# EAGLE design compact (EAGLE 9.4.2)
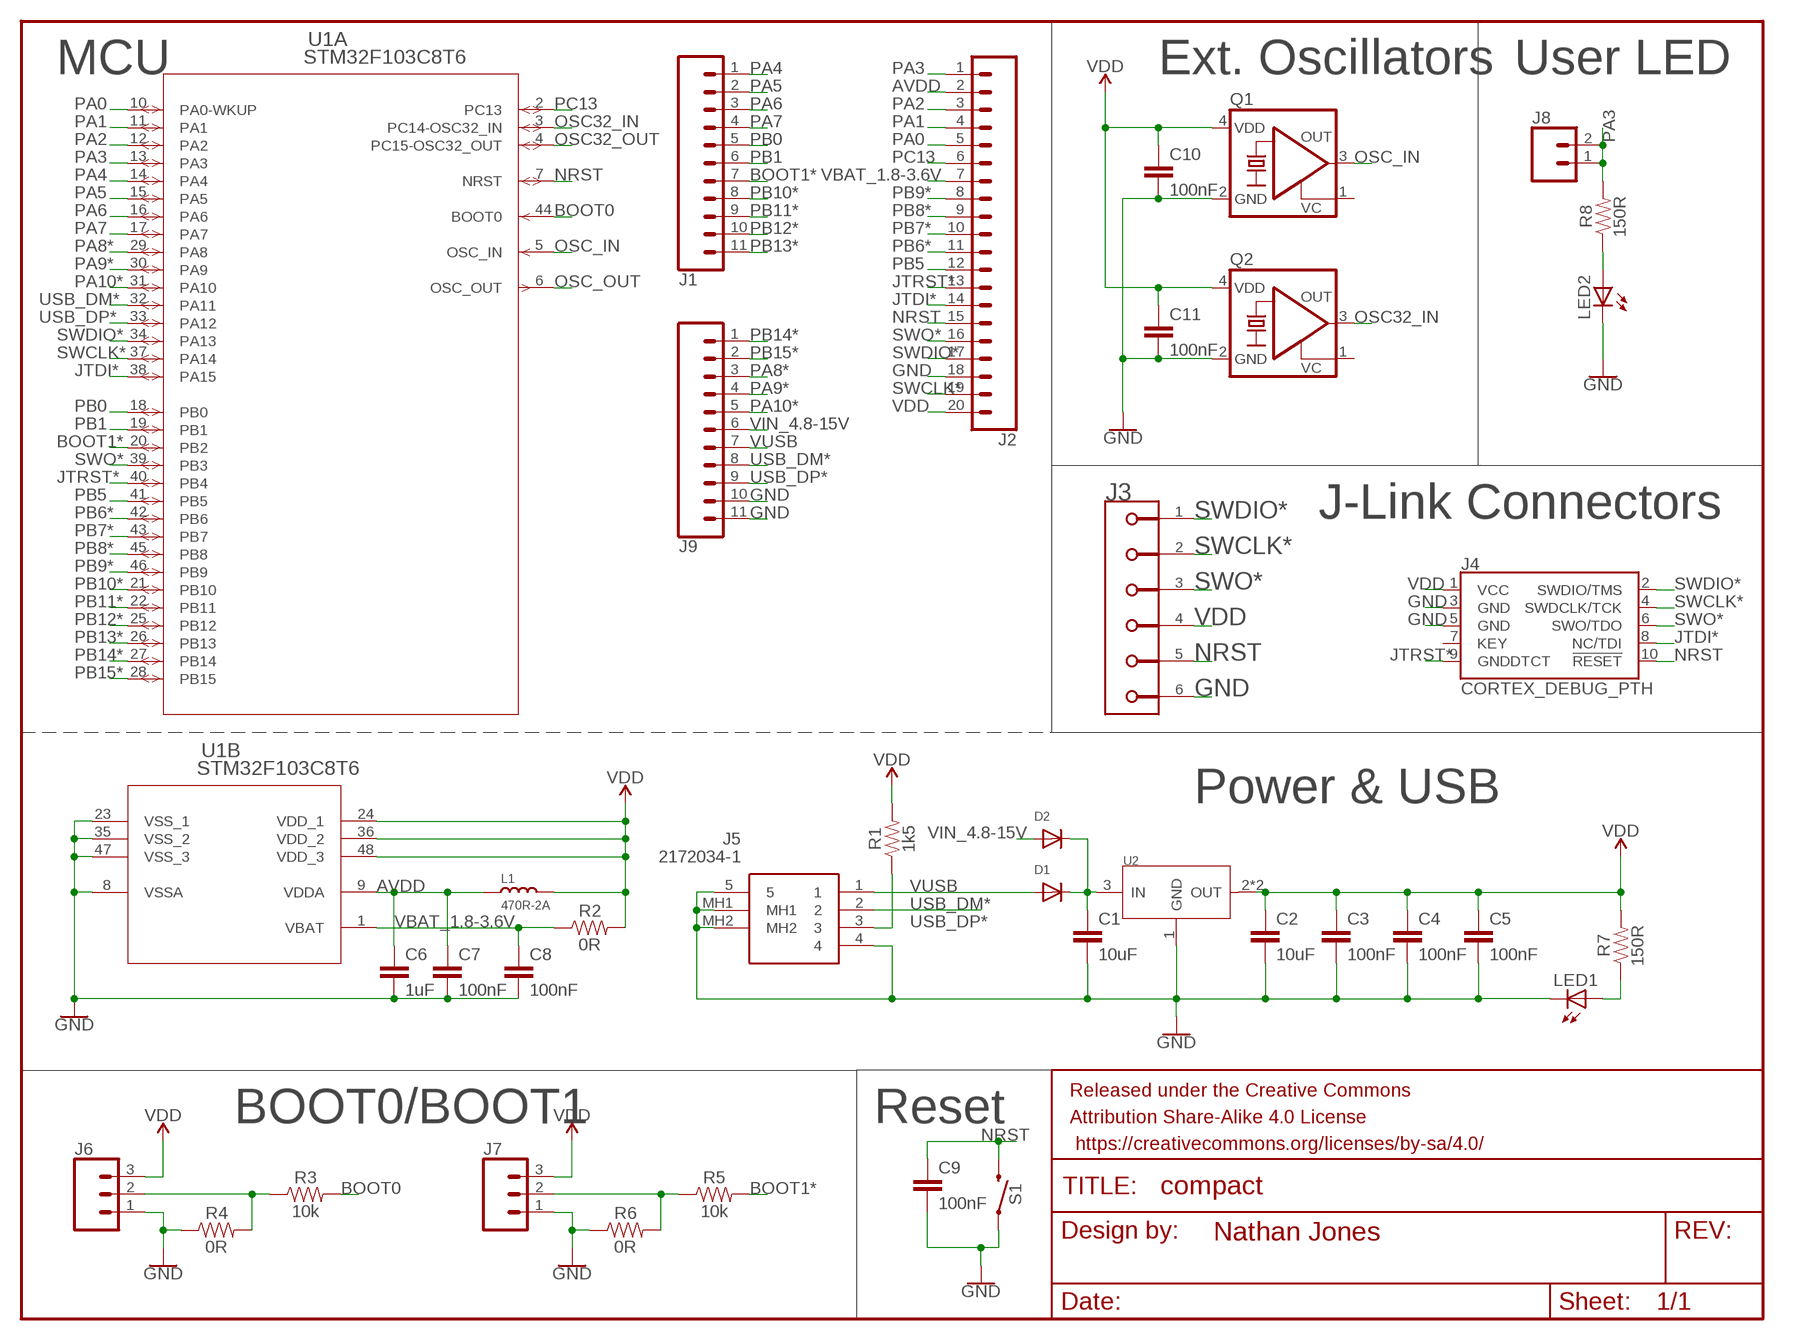
[diagram p0: schematic, sheet 1]

## Parts
C1  10uF  0.1UF-0402T-16V-10%  [0402-TIGHT]
C2  10uF  0.1UF-0402T-16V-10%  [0402-TIGHT]
C3  100nF  0.1UF-0402T-16V-10%  [0402-TIGHT]
C4  100nF  0.1UF-0402T-16V-10%  [0402-TIGHT]
C5  100nF  0.1UF-0402T-16V-10%  [0402-TIGHT]
C6  1uF  0.1UF-0402T-16V-10%  [0402-TIGHT]
C7  100nF  0.1UF-0402T-16V-10%  [0402-TIGHT]
C8  100nF  0.1UF-0402T-16V-10%  [0402-TIGHT]
C9  100nF  0.1UF-0402T-16V-10%  [0402-TIGHT]
C10  100nF  0.1UF-0402T-16V-10%  [0402-TIGHT]
C11  100nF  0.1UF-0402T-16V-10%  [0402-TIGHT]
D1  DIODESOD-123  [SOD-123]
D2  DIODESOD-123  [SOD-123]
FRAME2  FRAME-LETTERNO_PACKAGE  [DUMMY]
J1  CONN_111X11_NO_SILK  [1X11_NO_SILK]
J2  CONN_20NOSILK  [1X20_NOSILK]
J3  AVX_6-PIN_009159006061916_33MIL-GAP  [AVX_6-PIN_009159006061916_33MIL-GAP]
J4  CORTEX_DEBUG_PTH  [2X5-PTH-1.27MM]
J5  2172034-1  [21720341]
J6  CONN_031X03_NO_SILK  [1X03_NO_SILK]
J7  CONN_031X03_NO_SILK  [1X03_NO_SILK]
J8  CONN_021X02_NO_SILK  [1X02_NO_SILK]
J9  CONN_111X11_NO_SILK  [1X11_NO_SILK]
L1  470R-2A  SMD-FERRITE-BEAD-470R-2A(0805)'0805'  [L0805]
LED1  LEDCHIPLED_0603  [CHIPLED_0603]
LED2  LEDCHIPLED_0603  [CHIPLED_0603]
Q1  KXO-VCXO-CMOS_4  [3.2X2.5_KXO-84-TCXO]
Q2  KXO-VCXO-CMOS_4  [3.2X2.5_KXO-84-TCXO]
R1  1k5  RESISTOR0402  [0402]
R2  0R  RESISTOR0402  [0402]
R3  10k  RESISTOR0402  [0402]
R4  0R  RESISTOR0402  [0402]
R5  10k  RESISTOR0402  [0402]
R6  0R  RESISTOR0402  [0402]
R7  150R  RESISTOR0402  [0402]
R8  150R  RESISTOR0402  [0402]
S1  MOMENTARY-SWITCH-SPST-SMD-5.2-REDUNDANT  [TACTILE_SWITCH_SMD_5.2MM]
U1  STM32F103C8T6  [LQFP48-7X7MM]
U2  CJT1117-3.3-SOT223  PMIC-CJT1117-3.3(SOT223)  [SOT-223]

## Nets
AVDD: C6.1 C7.1 J2.2 L1.1 U1.9(B:VDDA)
BOOT0: R3.2 U1.44(A:BOOT0)
BOOT1*: J1.7 R5.2 U1.20(A:PB2)
GND: C1.2 C2.2 C3.2 C4.2 C5.2 C6.2 C7.2 C8.2 C9.2 C10.2 C11.2 J2.18 J3.6 J4.3(GND) J4.5(GND) J5.4 J5.5 J5.MH1 J5.MH2 J6.1 J7.1 J9.10 J9.11 LED1.C LED2.C Q1.2(GND) Q2.2(GND) R4.1 R6.1 S1.1 S1.2 U1.8(B:VSSA) U1.23(B:VSS_1) U1.35(B:VSS_2) U1.47(B:VSS_3) U2.1(GND)
JTDI*: J2.14 J4.8(NC/TDI) U1.38(A:PA15)
JTRST*: J2.13 J4.9(GNDDTCT) U1.40(A:PB4)
N$1: J6.2 R3.1 R4.2
N$4: LED2.A R8.1
N$6: J7.2 R5.1 R6.2
N$7: LED1.A R7.1
NRST: C9.1 J2.15 J3.5 J4.10(!RESET) S1.3 S1.4 U1.7(A:NRST)
OSC32_IN: Q2.3(OUT) U1.3(A:PC14-OSC32_IN)
OSC32_OUT: U1.4(A:PC15-OSC32_OUT)
OSC_IN: Q1.3(OUT) U1.5(A:OSC_IN)
OSC_OUT: U1.6(A:OSC_OUT)
PA0: J2.5 U1.10(A:PA0-WKUP)
PA1: J2.4 U1.11(A:PA1)
PA2: J2.3 U1.12(A:PA2)
PA3: J2.1 J8.1 J8.2 R8.2 U1.13(A:PA3)
PA4: J1.1 U1.14(A:PA4)
PA5: J1.2 U1.15(A:PA5)
PA6: J1.3 U1.16(A:PA6)
PA7: J1.4 U1.17(A:PA7)
PA8*: J9.3 U1.29(A:PA8)
PA9*: J9.4 U1.30(A:PA9)
PA10*: J9.5 U1.31(A:PA10)
PB0: J1.5 U1.18(A:PB0)
PB1: J1.6 U1.19(A:PB1)
PB5: J2.12 U1.41(A:PB5)
PB6*: J2.11 U1.42(A:PB6)
PB7*: J2.10 U1.43(A:PB7)
PB8*: J2.9 U1.45(A:PB8)
PB9*: J2.8 U1.46(A:PB9)
PB10*: J1.8 U1.21(A:PB10)
PB11*: J1.9 U1.22(A:PB11)
PB12*: J1.10 U1.25(A:PB12)
PB13*: J1.11 U1.26(A:PB13)
PB14*: J9.1 U1.27(A:PB14)
PB15*: J9.2 U1.28(A:PB15)
PC13: J2.6 U1.2(A:PC13)
SWCLK*: J2.19 J3.2 J4.4(SWDCLK/TCK) U1.37(A:PA14)
SWDIO*: J2.17 J3.1 J4.2(SWDIO/TMS) U1.34(A:PA13)
SWO*: J2.16 J3.3 J4.6(SWO/TDO) U1.39(A:PB3)
USB_DM*: J5.2 J9.8 U1.32(A:PA11)
USB_DP*: J5.3 J9.9 R1.1 U1.33(A:PA12)
VBAT_1.8-3.6V: C8.1 J2.7 R2.1 U1.1(B:VBAT)
VDD: C2.1 C3.1 C4.1 C5.1 C10.1 C11.1 J2.20 J3.4 J4.1(VCC) J6.3 J7.3 L1.2 Q1.4(VDD) Q2.4(VDD) R1.2 R2.2 R7.2 U1.24(B:VDD_1) U1.36(B:VDD_2) U1.48(B:VDD_3) U2.2(OUT) U2.TER(OUT)
VIN: C1.1 D1.C D2.C U2.3(IN)
VIN_4.8-15V: D2.A J9.6
VUSB: D1.A J5.1 J9.7
Unconnected: J4.7(KEY) Q1.1(VC) Q2.1(VC)

## Notes on the sheet
- MCU | Ext. Oscillators | User LED
- J-Link Connectors
- Power & USB
- BOOT0/BOOT1 | Reset

## Library data of the parts
C1 C2 = SparkFun-Capacitors:0.1UF: 0.1µF ceramic capacitors A capacitor is a passive two-terminal electrical component used to store electrical energy temporarily in an electric field.; LCSC_PART: C15525; PROD_ID: CAP-12416; VALUE: 0.1uF
C3-C5 C7-C11 = SparkFun-Capacitors:0.1UF: 0.1µF ceramic capacitors A capacitor is a passive two-terminal electrical component used to store electrical energy temporarily in an electric field.; LCSC_PART: C1525; PROD_ID: CAP-12416; VALUE: 0.1uF
C6 = SparkFun-Capacitors:0.1UF: 0.1µF ceramic capacitors A capacitor is a passive two-terminal electrical component used to store electrical energy temporarily in an electric field.; LCSC_PART: C52923; PROD_ID: CAP-12416; VALUE: 0.1uF
D1 D2 = adafruit:DIODE: Diode SMADIODE - SMA Surface Mount Package 20V 1A Schottky Diode Digikey: 641-1014-6-ND DO-1N4148 - Through Hole Small Current Diode SOD-123 20V 1 A (.5mV Vf) Schottky Diode - Digikey: MBRX120TPMSCT-ND SOD-323 10V 570mA (.38mV Vf, 3ns) Schottky Diode - Digikey: ZLLS410CT-ND SOD-523 30V 30mA Schottky Diode (RB751S-40TE61) - Digikey: RB751S-40TE61CT-ND SOT23-R/W - SOT23 Package (R = Solder Paste/Reflow Ovens, W = Hand-Soldering) BAT54Film 40V 300mA - Digikey: 497-7162-1-ND; LCSC_PART: C8598
FRAME2 = SparkFun-Aesthetics:FRAME-LETTER: Schematic Frame - Letter Standard 8.5x11 US Letter frame; DESIGNER: Nathan Jones; VERSION: v01
J1 J9 = SparkFun-Connectors:CONN_11: Multi connection point. Often used as Generic Header-pin footprint for 0.1 inch spaced/style header connections On any of the 0.1 inch spaced packages, you can populate with these: Break Away Headers - Straight <https://www.sparkfun.com/products/116> (PRT-00116) Break Away Male Headers - Right Angle <https://www.sparkfun.com/products/553> (PRT-00553) Female Headers <https://www.sparkfun.com/products/115> (PRT-00115) Break Away Headers - Machine Pin <https://www.sparkfun.com/products/117> (PRT-00117) Break Away Female Headers - Swiss Machine Pin <https://www.sparkfun.com/products/743> (PRT-00743) For SCREWTERMINALS and SPRING TERMINALS visit here: Screw Terimnals on SparkFun.com <https://www.sparkfun.com/search/results?term=Screw+Terminals> (5mm/3.5mm/2.54mm spacing) This device is also useful as a general connection point to wire up your design to another part of your project. Our various solder wires solder well into these plated through hole pads. Hook-Up Wire - Assortment (Stranded, 22 AWG) <https://www.sparkfun.com/products/11375> (PRT-11375) Hook-Up Wire - Assortment (Solid Core, 22 AWG) <https://www.sparkfun.com/products/11367> (PRT-11367) View the entire wire category on our website here <https://www.sparkfun.com/categories/141>
J2 = SparkFun-Connectors:CONN_20: Multi connection point. Often used as Generic Header-pin footprint for 0.1 inch spaced/style header connections On any of the 0.1 inch spaced packages, you can populate with these: Break Away Headers - Straight <https://www.sparkfun.com/products/116> (PRT-00116) Break Away Male Headers - Right Angle <https://www.sparkfun.com/products/553> (PRT-00553) Female Headers <https://www.sparkfun.com/products/115> (PRT-00115) Break Away Headers - Machine Pin <https://www.sparkfun.com/products/117> (PRT-00117) Break Away Female Headers - Swiss Machine Pin <https://www.sparkfun.com/products/743> (PRT-00743) For SCREWTERMINALS and SPRING TERMINALS visit here: Screw Terimnals on SparkFun.com <https://www.sparkfun.com/search/results?term=Screw+Terminals> (5mm/3.5mm/2.54mm spacing) This device is also useful as a general connection point to wire up your design to another part of your project. Our various solder wires solder well into these plated through hole pads. Hook-Up Wire - Assortment (Stranded, 22 AWG) <https://www.sparkfun.com/products/11375> (PRT-11375) Hook-Up Wire - Assortment (Solid Core, 22 AWG) <https://www.sparkfun.com/products/11367> (PRT-11367) View the entire wire category on our website here <https://www.sparkfun.com/categories/141> Special notes: Molex polarized connector foot print use with SKU : PRT-08231 with associated crimp pins and housings. 1MM SMD Version SKU: PRT-10208 NOTES ON THE VARIANTS LOCK and LOCK_LONGPADS... This footprint was designed to help hold the alignment of a through-hole component (i.e. 6-pin header) while soldering it into place. You may notice that each hole has been shifted either up or down by 0.005 of an inch from it's more standard position (which is a perfectly straight line). This slight alteration caused the pins (the squares in the middle) to touch the edges of the holes. Because they are alternating, it causes a "brace" to hold the component in place. 0.005 has proven to be the perfect amount of "off-center" position when using our standard breakaway headers. Although looks a little odd when you look at the bare footprint, once you have a header in there, the alteration is very hard to notice. Also,if you push a header all the way into place, it is covered up entirely on the bottom side. Note about LOCK SPECIAL package: This is just like the LOCK variant in that the holes are staggared by 5 mil, but except for the last two holes. They are not altered from the "standard" footprint layout. This is used for a special purpose on the layout of our Graphic LCD Backpack. Make sure you want to use this device before selecting it for you project!
J3 = Debug-Edge_AVX-connectors:AVX_6-PIN_009159006061916_33MIL-GAP
J4 = SparkFun-Connectors:CORTEX_DEBUG: Cortex Debug Connector - 10 pin Supports JTAG debug, Serial Wire debug, and Serial Wire Viewer. PTH and SMD connector options available. General Connector Information <http://infocenter.arm.com/help/topic/com.arm.doc.faqs/attached/13634/cortex_debug_connectors.pdf> Products: PTH Connector <http://www.digikey.com/product-detail/en/cnc-tech/3220-10-0100-00/1175-1627-ND/3883661> -via Digi-Key SparkFun PSoc <https://www.sparkfun.com/products/13229> SparkFun T <https://www.sparkfun.com/products/13810>
J5 = 2172034-1:2172034-1: CONN RCPT USB MINI B 2.0 PCB R/A Source: Datasheet <https://www.te.com/commerce/DocumentDelivery/DDEController?Action=srchrtrv&DocNm=2172034&DocType=Customer Drawing&DocLang=English>; ARROW_PART_NUMBER: 2172034-1; ARROW_PRICE-STOCK: https://www.arrow.com/en/products/2172034-1/te-connectivity; DESCRIPTION: CONN RCPT USB MINI B 2.0 PCB R/A; HEIGHT: 3.9mm; MANUFACTURER_NAME: TE Connectivity; MANUFACTURER_PART_NUMBER: 2172034-1; MOUSER_PART_NUMBER: 571-2172034-1; MOUSER_PRICE-STOCK: https://www.mouser.co.uk/ProductDetail/TE-Connectivity/2172034-1/?qs=Ev%252BS503VEAHBC%252BPBdsvCGg%3D%3D
J6 J7 = SparkFun-Connectors:CONN_03: Multi connection point. Often used as Generic Header-pin footprint for 0.1 inch spaced/style header connections On any of the 0.1 inch spaced packages, you can populate with these: Break Away Headers - Straight <https://www.sparkfun.com/products/116> (PRT-00116) Break Away Male Headers - Right Angle <https://www.sparkfun.com/products/553> (PRT-00553) Female Headers <https://www.sparkfun.com/products/115> (PRT-00115) Break Away Headers - Machine Pin <https://www.sparkfun.com/products/117> (PRT-00117) Break Away Female Headers - Swiss Machine Pin <https://www.sparkfun.com/products/743> (PRT-00743) Stackable Header - 3 Pin (Female, 0.1") <https://www.sparkfun.com/products/13875> (PRT-13875) For SCREWTERMINALS and SPRING TERMINALS visit here: Screw Terimnals on SparkFun.com <https://www.sparkfun.com/search/results?term=Screw+Terminals> (5mm/3.5mm/2.54mm spacing) This device is also useful as a general connection point to wire up your design to another part of your project. Our various solder wires solder well into these plated through hole pads. Hook-Up Wire - Assortment (Stranded, 22 AWG) <https://www.sparkfun.com/products/11375> (PRT-11375) Hook-Up Wire - Assortment (Solid Core, 22 AWG) <https://www.sparkfun.com/products/11367> (PRT-11367) View the entire wire category on our website here <https://www.sparkfun.com/categories/141> Special notes: Molex polarized connector foot print use with SKU : PRT-08232 with associated crimp pins and housings.
J8 = SparkFun-Connectors:CONN_02: Multi connection point. Often used as Generic Header-pin footprint for 0.1 inch spaced/style header connections On any of the 0.1 inch spaced packages, you can populate with these: Break Away Headers - Straight <https://www.sparkfun.com/products/116> (PRT-00116) Break Away Male Headers - Right Angle <https://www.sparkfun.com/products/553> (PRT-00553) Female Headers <https://www.sparkfun.com/products/115> (PRT-00115) Break Away Headers - Machine Pin <https://www.sparkfun.com/products/117> (PRT-00117) Break Away Female Headers - Swiss Machine Pin <https://www.sparkfun.com/products/743> (PRT-00743) For SCREWTERMINALS and SPRING TERMINALS visit here: Screw Terimnals on SparkFun.com <https://www.sparkfun.com/search/results?term=Screw+Terminals> (5mm/3.5mm/2.54mm spacing) This device is also useful as a general connection point to wire up your design to another part of your project. Our various solder wires solder well into these plated through hole pads. Hook-Up Wire - Assortment (Stranded, 22 AWG) <https://www.sparkfun.com/products/11375> (PRT-11375) Hook-Up Wire - Assortment (Solid Core, 22 AWG) <https://www.sparkfun.com/products/11367> (PRT-11367) View the entire wire category on our website here <https://www.sparkfun.com/categories/141> Special notes: Molex polarized connector foot print use with: PRT-08233 with associated crimp pins and housings. 2.54_SCREWTERM for use with PRT-10571. 3.5mm Screw Terminal footprints for PRT-08084 5mm Screw Terminal footprints for use with PRT-08432
L1 = OPL_Ferrite_and_Magnetic_Bead:SMD-FERRITE-BEAD-470R-2A(0805): 303030008; LCSC_PART: C1015; MPN: WLB2012-471T20
LED1 = adafruit:LED: LED OSRAM: - CHIPLED LG R971, LG N971, LY N971, LG Q971, LY Q971, LO R971, LY R971 LH N974, LH R974 LS Q976, LO Q976, LY Q976 LO Q996 - Hyper CHIPLED LW Q18S LB Q993, LB Q99A, LB R99A - SideLED LS A670, LO A670, LY A670, LG A670, LP A670 LB A673, LV A673, LT A673, LW A673 LH A674 LY A675 LS A676, LA A676, LO A676, LY A676, LW A676 LS A679, LY A679, LG A679 - Hyper Micro SIDELED® LS Y876, LA Y876, LO Y876, LY Y876 LT Y87S - SmartLED LW L88C, LW L88S LB L89C, LB L89S, LG L890 LS L89K, LO L89K, LY L89K LS L896, LA L896, LO L896, LY L896 - TOPLED LS T670, LO T670, LY T670, LG T670, LP T670 LSG T670, LSP T670, LSY T670, LOP T670, LYG T670 LG T671, LOG T671, LSG T671 LB T673, LV T673, LT T673, LW T673 LH T674 LS T676, LA T676, LO T676, LY T676, LB T676, LH T676, LSB T676, LW T676 LB T67C, LV T67C, LT T67C, LS T67K, LO T67K, LY T67K, LW E67C LS E67B, LA E67B, LO E67B, LY E67B, LB E67C, LV E67C, LT E67C LW T67C LS T679, LY T679, LG T679 LS T770, LO T770, LY T770, LG T770, LP T770 LB T773, LV T773, LT T773, LW T773 LH T774 LS E675, LA E675, LY E675, LS T675 LS T776, LA T776, LO T776, LY T776, LB T776 LHGB T686 LT T68C, LB T68C - Hyper Mini TOPLED® LB M676 - Mini TOPLED Santana® LG M470 LS M47K, LO M47K, LY M47K Source: http://www.osram.convergy.de/; LCSC_PART: C72041
LED2 = adafruit:LED: LED OSRAM: - CHIPLED LG R971, LG N971, LY N971, LG Q971, LY Q971, LO R971, LY R971 LH N974, LH R974 LS Q976, LO Q976, LY Q976 LO Q996 - Hyper CHIPLED LW Q18S LB Q993, LB Q99A, LB R99A - SideLED LS A670, LO A670, LY A670, LG A670, LP A670 LB A673, LV A673, LT A673, LW A673 LH A674 LY A675 LS A676, LA A676, LO A676, LY A676, LW A676 LS A679, LY A679, LG A679 - Hyper Micro SIDELED® LS Y876, LA Y876, LO Y876, LY Y876 LT Y87S - SmartLED LW L88C, LW L88S LB L89C, LB L89S, LG L890 LS L89K, LO L89K, LY L89K LS L896, LA L896, LO L896, LY L896 - TOPLED LS T670, LO T670, LY T670, LG T670, LP T670 LSG T670, LSP T670, LSY T670, LOP T670, LYG T670 LG T671, LOG T671, LSG T671 LB T673, LV T673, LT T673, LW T673 LH T674 LS T676, LA T676, LO T676, LY T676, LB T676, LH T676, LSB T676, LW T676 LB T67C, LV T67C, LT T67C, LS T67K, LO T67K, LY T67K, LW E67C LS E67B, LA E67B, LO E67B, LY E67B, LB E67C, LV E67C, LT E67C LW T67C LS T679, LY T679, LG T679 LS T770, LO T770, LY T770, LG T770, LP T770 LB T773, LV T773, LT T773, LW T773 LH T774 LS E675, LA E675, LY E675, LS T675 LS T776, LA T776, LO T776, LY T776, LB T776 LHGB T686 LT T68C, LB T68C - Hyper Mini TOPLED® LB M676 - Mini TOPLED Santana® LG M470 LS M47K, LO M47K, LY M47K Source: http://www.osram.convergy.de/; LCSC_PART: C72038
Q1 = crystal-geyer_V1_0:KXO-VCXO-CMOS_4: VCXO : CMOS - Serie Model Size l/w/h [mm] Frequency Range Frequency Stability Temp. Range [°C] Output AECQ 200 availabel Datasheet KXO-84 3.2/2.5/1.0 1.25 ~ 54.0 MHz ±10 … ±50ppm (*) -40°C …+85°C CMOS - KXO-84.pdf <http://www.geyer-electronic.de/uploads/tx_userartikelfrequenz/GEYER-KXO-84-VCXO-CMOS.pdf> <http://www.geyer-electronic.de/fileadmin/template/img/logo-geyer-electronic.png> Details see: http://www.geyer-electronic.de/Frequenz-Produkte.9.0.html Created 2016-06-07, Hans Locher 2016 (C) Geyer Quartz Technology KX84;3,2x2,5;3.2x2.5;3225; LCSC_PART: C39097
Q2 = crystal-geyer_V1_0:KXO-VCXO-CMOS_4: VCXO : CMOS - Serie Model Size l/w/h [mm] Frequency Range Frequency Stability Temp. Range [°C] Output AECQ 200 availabel Datasheet KXO-84 3.2/2.5/1.0 1.25 ~ 54.0 MHz ±10 … ±50ppm (*) -40°C …+85°C CMOS - KXO-84.pdf <http://www.geyer-electronic.de/uploads/tx_userartikelfrequenz/GEYER-KXO-84-VCXO-CMOS.pdf> <http://www.geyer-electronic.de/fileadmin/template/img/logo-geyer-electronic.png> Details see: http://www.geyer-electronic.de/Frequenz-Produkte.9.0.html Created 2016-06-07, Hans Locher 2016 (C) Geyer Quartz Technology KX84;3,2x2,5;3.2x2.5;3225; LCSC_PART: C387415
R1 = SparkFun-Resistors:RESISTOR: Generic Resistor Package; LCSC_PART: C25867
R2 R4 R6 = SparkFun-Resistors:RESISTOR: Generic Resistor Package; LCSC_PART: C17168
R3 R5 = SparkFun-Resistors:RESISTOR: Generic Resistor Package; LCSC_PART: C25744
R7 R8 = SparkFun-Resistors:RESISTOR: Generic Resistor Package; LCSC_PART: C25082
S1 = SparkFun-Switches:MOMENTARY-SWITCH-SPST: Momentary Switch (Pushbutton) - SPST Normally-open (NO) SPST momentary switches (buttons, pushbuttons). Variants PTH-12MM - 12mm square, through-hole Momentary Pushbutton Switch - 12mm Square <https://www.sparkfun.com/products/9190> (COM-09190) PTH-6.0MM, PTH-6.0MM-KIT - 6.0mm square, through-hole Mini Pushbutton Switch <https://www.sparkfun.com/products/97> (COM-00097) KIT package intended for soldering kit's - only one side of pads' copper is exposed. PTH-RIGHT-ANGLE-KIT - Right-angle, through-hole Right Angle Tactile Button <https://www.sparkfun.com/products/10791> - Used on SparkFun BigTime Watch Kit <https://www.sparkfun.com/products/11734> SMD-12MM - 12mm square, surface-mount Tactile Button - SMD (12mm) <https://www.sparkfun.com/products/12993> (COM-12993) Used on SparkFun PicoBoard <https://www.sparkfun.com/products/11888> SMD-4.5MM - 4.5mm Square Trackball Switch Used on SparkFun Blackberry Trackballer Breakout <https://www.sparkfun.com/products/13169> SMD-4.6MMX2.8MM - 4.60mm x 2.80mm, surface mount Used on SparkFun SAMD21 Mini Breakout <https://www.sparkfun.com/products/13664> SMD-5.2MM, SMD-5.2-REDUNDANT - 5.2mm square, surface-mount Mini Pushbutton Switch - SMD <https://www.sparkfun.com/products/8720> (COM-08720) Used on Arduino Pro Mini <https://www.sparkfun.com/products/11114> REDUNDANT package connects both switch circuits together SMD-6.0X3.5MM - 6.0 x 3.5mm, surface mount Momentary Reset Switch SMD <https://www.sparkfun.com/products/8229> (COM-08229) SMD-6.2MM-TALL - 6.2mm square, surface mount Tactile Button - SMD (6mm) <https://www.sparkfun.com/products/12992> Used on SparkFun Digital Sandbox <https://www.sparkfun.com/products/12651> SMD-RIGHT-ANGLE - Right-angle, surface mount Used on SparkFun Block for Intel® Edison - Arduino <https://www.sparkfun.com/products/13036>; LCSC_PART: C318884; PROD_ID: SWCH-08247; SF_SKU: COM-08720
U1 = STM32F103C8T6:STM32F103C8T6; BUILT_BY: EMA_UL_Team; COPYRIGHT: Copyright (C) 2018 Accelerated Designs. All rights reserved; LCSC_PART: C94046; MANUFACTURER_PART_NUMBER: STM32F103C8T6; SOURCELIBRARY: Updates_to_database_2020-10-19; VENDOR: STMicroelectronics
U2 = OPL_IC:PMIC-CJT1117-3.3(SOT223): 310030097; LCSC_PART: C6186; MPN: CJT1117-3.3

## Board
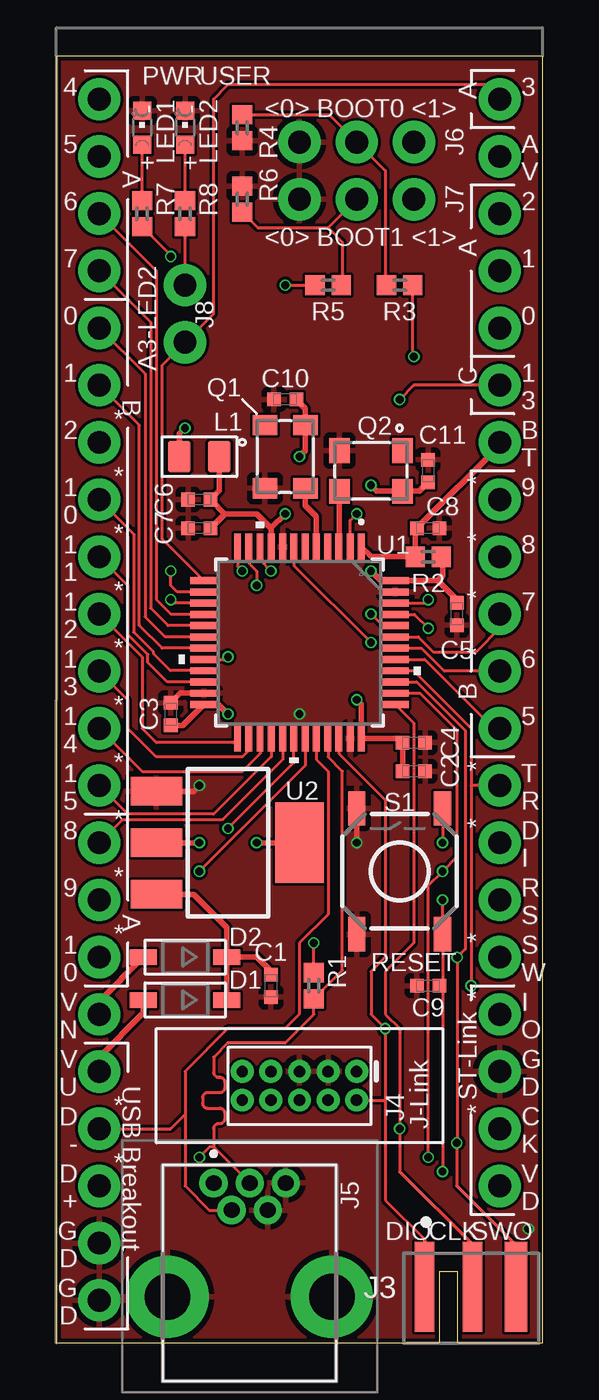
[diagram p1: board, top side]
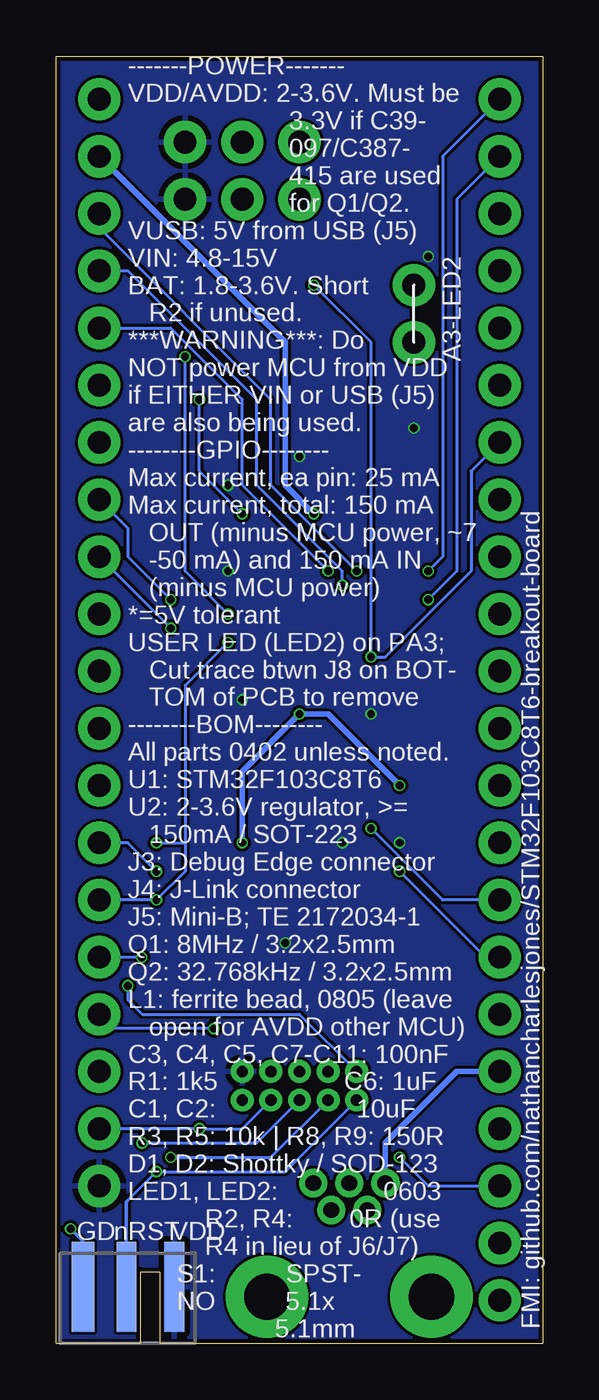
[diagram p2: board, bottom side, seen from below]

Size 21.59 x 57.15 mm. Coordinates in mm from the lower left corner, seen from the top.
Outline: 21.59,0 21.59,57.15 0,57.15 0,0 16.99,0 16.99,3.17 17.83,3.17 17.83,0 21.59,0
Copper layers (1*16): Top 0.035mm / dielectric 1.6mm / Bottom 0.035mm
Design rules "jlcpcb-2layers": minimum track width 5mil, minimum drill 0.3mm, track to track 5mil, track to pad 5mil, pad to pad 5mil, via to via 5mil, smd to smd 5mil, copper to edge 0.2mm, drill to drill 6mil, minimum pad ring 10mil, minimum via ring 3mil, stop-mask expansion 4mil, vias tented up to drill 0mil, thermal gap 10mil

### Footprints (pad centres in the part's own frame; a part is rotated, then mirrored left to right if it is on the bottom)
0402-TIGHT = smd 0.6 x 0.6: 1 -0.5,0; 2 0.5,0
SOD-123 = smd 1.2 x 0.7: A 1.85,0; C -1.85,0
1X11_NO_SILK = drill 1.016 pad 1.88: 1 0,0; 2 2.54,0; 3 5.08,0; 4 7.62,0; 5 10.16,0; 6 12.7,0; 7 15.24,0; 8 17.78,0; 9 20.32,0; 10 22.86,0; 11 25.4,0
1X20_NOSILK = drill 1.016 pad 1.88: 1 0,0; 2 2.54,0; 3 5.08,0; 4 7.62,0; 5 10.16,0; 6 12.7,0; 7 15.24,0; 8 17.78,0; 9 20.32,0; 10 22.86,0; 11 25.4,0; 12 27.94,0; 13 30.48,0; 14 33.02,0; 15 35.56,0; 16 38.1,0; 17 40.64,0; 18 43.18,0; 19 45.72,0; 20 48.26,0
AVX_6-PIN_009159006061916_33MIL-GAP = smd 0.873 x 4: 1 -2.063,2.5; 2 0.064,2.5 | smd 1 x 4: 3 2,2.5 | smd 0.873 x 4 bottom: 4 -2.063,2.5; 5 0.064,2.5 | smd 1 x 4 bottom: 6 2,2.5
2X5-PTH-1.27MM = drill 0.508 pad 1: 1 -2.54,-0.635; 2 -2.54,0.635; 3 -1.27,-0.635; 4 -1.27,0.635; 5 0,-0.635; 6 0,0.635; 7 1.27,-0.635; 8 1.27,0.635; 9 2.54,-0.635; 10 2.54,0.635
21720341 = drill 0.7 pad 1.2: 1 0,0; 2 1.2,0.8; 3 0,1.6; 4 1.2,2.4; 5 0,3.2 | drill 2.025 pad 3.037: MH1 5.05,5.25; MH2 5.05,-2.05
1X03_NO_SILK = drill 1.016 pad 1.88: 1 0,0; 2 2.54,0; 3 5.08,0
1X02_NO_SILK = drill 1.016 pad 1.88: 1 0,0; 2 2.54,0
L0805 = smd 1.016 x 1.397: 1 -0.889,0; 2 0.889,0
CHIPLED_0603 = smd 0.8 x 0.8: A 0,-0.75; C 0,0.75
3.2X2.5_KXO-84-TCXO = smd 0.9 x 1.1: 1 -1.4,-0.9; 2 1.4,-0.9; 3 1.4,0.9; 4 -1.4,0.9
0402 = smd 0.85 x 0.9: 1 -0.58,0; 2 0.58,0
TACTILE_SWITCH_SMD_5.2MM = smd 1.524 x 0.762: 1 -2.794,1.905; 2 2.794,1.905; 3 -2.794,-1.905; 4 2.794,-1.905
LQFP48-7X7MM = smd 1.194 x 0.305: 1 -4.25,2.75; 2 -4.25,2.25; 3 -4.25,1.75; 4 -4.25,1.25; 5 -4.25,0.75; 6 -4.25,0.25; 7 -4.25,-0.25; 8 -4.25,-0.75; 9 -4.25,-1.25; 10 -4.25,-1.75; 11 -4.25,-2.25; 12 -4.25,-2.75; 25 4.25,-2.75; 26 4.25,-2.25; 27 4.25,-1.75; 28 4.25,-1.25; 29 4.25,-0.75; 30 4.25,-0.25; 31 4.25,0.25; 32 4.25,0.75; 33 4.25,1.25; 34 4.25,1.75; 35 4.25,2.25; 36 4.25,2.75 | smd 0.305 x 1.194: 13 -2.75,-4.25; 14 -2.25,-4.25; 15 -1.75,-4.25; 16 -1.25,-4.25; 17 -0.75,-4.25; 18 -0.25,-4.25; 19 0.25,-4.25; 20 0.75,-4.25; 21 1.25,-4.25; 22 1.75,-4.25; 23 2.25,-4.25; 24 2.75,-4.25; 37 2.75,4.25; 38 2.25,4.25; 39 1.75,4.25; 40 1.25,4.25; 41 0.75,4.25; 42 0.25,4.25; 43 -0.25,4.25; 44 -0.75,4.25; 45 -1.25,4.25; 46 -1.75,4.25; 47 -2.25,4.25; 48 -2.75,4.25
SOT-223 = smd 1.27 x 2.286: 1 -2.286,-3.175; 2 0,-3.175; 3 2.286,-3.175 | smd 3.556 x 2.159: TER 0,3.175

### Placement (x,y rotation side)
C1  9.53,15.88 270 top
C2  15.88,25.4 0 top
C3  5.08,27.94 90 top
C4  15.88,26.67 0 top
C5  17.78,32.38 270 top
C6  6.35,37.47 180 top
C7  6.35,36.2 180 top
C8  16.51,36.2 0 top
C9  16.51,15.88 180 top
C10  10.16,41.91 180 top
C11  16.51,38.73 90 top
D1  5.71,15.24 180 top
D2  5.71,17.14 180 top
FRAME2  0,0 0 top
J1  1.91,55.24 270 top
J2  19.68,55.24 270 top
J3  18.41,0 0 top
J4  10.79,11.43 180 top
J5  6.99,7.11 270 top
J6  10.79,53.34 0 top
J7  10.79,50.8 0 top
J8  5.71,44.45 90 top
J9  1.91,27.3 270 top
L1  6.35,39.37 180 top
LED1  3.81,53.98 0 top
LED2  5.71,53.98 0 top
Q1  10.16,39.37 270 top
Q2  13.97,38.73 180 top
R1  11.43,15.88 90 top
R2  16.51,34.92 0 top
R3  15.24,46.99 0 top
R4  8.26,53.98 90 top
R5  12.06,46.99 180 top
R6  8.26,50.8 270 top
R7  3.81,50.16 270 top
R8  5.71,50.16 270 top
S1  15.24,20.95 90 top
U1  10.79,31.11 270 top
U2  7.62,22.23 270 top

### Tracks (layer width: path | path; a pad name or v marks a point on that pad's centre or on a via)
AVDD  (via drill 0.35)
  Top 0.254: 9.54,36.17 8.89,36.83 7.49,36.83 | 9.54,36.17 9.54,36.22 v10.16,36.83 | 9.54,36.17 U1.9 | L1.1 7.24,37.85 C6.1 7.49,36.83 | C7.1 7.49,36.83
  Bottom 0.254: v10.16,36.83 11.43,38.1 11.43,44.45 J2.2
BOOT0  (via drill 0.35)
  Top 0.127: U1.44 14.49,31.86 v13.97,32.38 | v15.88,43.81 15.82,43.87 R3.2
  Bottom 0.127: v13.97,32.38 15.88,34.29 v15.88,43.81
BOOT1*  (via drill 0.35)
  Top 0.127: U1.20 7.5,30.36 v7.62,30.48 | v10.16,46.99 R5.2
  Bottom 0.127: v10.16,46.99 7.62,44.45 v7.62,30.48 6.99,30.48 3.17,34.29 3.17,38.73 J1.7
GND  (via drill 0.35)
  Top 0.254: U2.1 6.1,24.51 v6.35,24.77 | S1.2 v13.34,22.23 | C3.2 5.5,28.86 U1.23
  Bottom 0.152: J3.6 20.41,4.54 v20.95,5.08
  Bottom 0.254: v6.35,24.77 9.53,27.94 v10.79,27.94 13.34,25.4 v13.34,22.23
  pour Top: 0,57.15 21.59,57.15 21.59,0 0,0
JTDI*  (via drill 0.35)
  Top 0.127: U1.38 16.14,28.86 17.78,27.22 17.78,21.59 v17.14,20.95 16.51,20.32 v16.51,8.26
  Bottom 0.127: v16.51,8.26 12.06,8.26 J4.8 | v17.14,20.95 18.41,22.23 J2.14
JTRST*  (via drill 0.35)
  Top 0.127: U1.40 15.86,29.86 18.41,27.3 18.41,24.77 | J2.13 18.41,24.77 | 18.41,24.77 v18.41,15.88
  Bottom 0.127: v18.41,15.88 18.41,15.24 17.78,14.61 10.79,14.61 J4.9
N$1
  Top 0.127: R3.1 14.61,47.05 14.61,52.07 J6.2 12.12,54.55 R4.2
N$4
  Top 0.127: R8.1 LED2.A
N$6
  Top 0.127: 12.06,49.53 12.7,48.9 12.7,47.05 R5.1 | J7.2 12.06,49.53 | R6.2 8.95,49.53 12.06,49.53
N$7
  Top 0.127: R7.1 LED1.A
NRST  (via drill 0.35)
  Top 0.127: v17.14,19.68 S1.3 17.14,16.01 C9.1 17.14,15.74 v17.14,7.62 | U1.7 10.54,34.54 v13.97,31.11 | S1.4 v17.14,22.23
  Bottom 0.127: J2.15 v17.14,19.68 15.88,20.95 15.88,22.23 | J4.10 11.43,7.62 v17.14,7.62 18.41,6.35 | v13.97,31.11 15.88,29.21 15.88,22.23 | v17.14,22.23 15.88,22.23
  Bottom 0.152: 18.41,6.35 18.48,6.29 J3.5
OSC32_IN
  Top 0.254: Q2.3 12.57,35.39 U1.3
OSC_IN
  Top 0.254: U1.5 11.54,36.72 11.06,37.2 Q1.3
PA0  (via drill 0.35)
  Top 0.127: U1.10 9.04,34.77 v9.53,34.29
  Bottom 0.127: v9.53,34.29 13.34,38.1 13.34,41.91 16.51,45.09 J2.5
PA1  (via drill 0.35)
  Top 0.127: U1.11 8.54,34.63 8.89,34.29 v8.89,33.66
  Bottom 0.127: J2.4 18.41,47.62 12.7,41.91 12.7,38.1 8.89,34.29 v8.89,33.66
PA2  (via drill 0.35)
  Top 0.127: U1.12 8.04,34.5 v8.26,34.29
  Bottom 0.127: v8.26,34.29 12.06,38.1 12.06,41.91 19.68,49.53 J2.3
PA3
  Top 0.127: J2.1 19.05,55.88 7.62,55.88 6.99,55.24 6.99,45.72 J8.1 4.7,43.43 4.7,35.71 U1.13 | J8.2 R8.2
  Bottom 0.127: J8.1 J8.2
PA4  (via drill 0.35)
  Top 0.127: U1.14 5.37,33.37 5.08,33.66 v5.08,34.29
  Bottom 0.127: v5.08,34.29 4.45,34.92 4.45,52.7 J1.1
PA5  (via drill 0.35)
  Top 0.127: U1.15 5.24,32.87 v5.08,33.02
  Bottom 0.127: v5.08,33.02 3.81,34.29 3.81,50.8 J1.2
PA6
  Top 0.127: U1.16 5.1,32.37 4.45,33.02 4.45,47.62 J1.3
PA7
  Top 0.127: U1.17 4.96,31.86 4.19,32.64 4.19,45.34 J1.4
PA8*
  Top 0.127: U1.29 10.04,25.92 7.37,23.24 2.92,23.24 J9.3
PA9*  (via drill 0.35)
  Top 0.127: U1.30 10.54,25.79 v7.62,22.86
  Bottom 0.127: J9.4 4.45,19.68 v7.62,22.86
PA10*  (via drill 0.35)
  Top 0.127: U1.31 11.04,25.65 v6.35,20.95
  Bottom 0.127: v6.35,20.95 2.54,17.14 J9.5
PB0
  Top 0.127: U1.18 4.83,31.36 3.94,32.26 3.94,43.05 J1.5
PB1
  Top 0.127: U1.19 4.7,30.86 3.68,31.88 3.68,40.77 J1.6
PB5
  Top 0.127: U1.41 16.35,30.36 19.41,27.3 J2.12
PB6*
  Top 0.127: U1.42 16.21,30.86 17.23,29.84 J2.11
PB7*
  Top 0.127: U1.43 16.07,31.36 16.73,30.7 18.64,30.7 19.68,31.75 J2.10
PB8*  (via drill 0.35)
  Top 0.127: U1.45 15.89,32.37 v16.51,31.75
  Bottom 0.127: v16.51,31.75 J2.9
PB9*  (via drill 0.35)
  Top 0.127: U1.46 16.36,32.87 v16.51,33.02
  Bottom 0.127: v16.51,33.02 18.41,34.92 18.41,36.2 J2.8
PB10*
  Top 0.127: U1.21 5.06,29.86 4.32,30.61 4.32,30.69 3.43,31.58 3.43,35.94 J1.8
PB11*
  Top 0.127: U1.22 4.92,29.36 4.06,30.23 4.06,30.59 3.17,31.47 3.17,33.66 J1.9
PB12*
  Top 0.127: U1.25 7.85,26.67 4.45,26.67 3.81,27.3 3.81,30.48 J1.10
PB13*
  Top 0.127: U1.26 8.54,26.32 8.26,26.04 4.45,26.04 3.17,27.3 3.17,28.57 J1.11
PB14*
  Top 0.127: U1.27 9.04,26.19 8.26,25.4 3.81,25.4 J9.1
PB15*
  Top 0.127: U1.28 9.54,26.05 6.99,23.5 3.17,23.5 J9.2
PC13  (via drill 0.35)
  Top 0.127: U1.2 13.04,36.54 v13.34,36.83 | v15.24,41.91 15.88,42.55 J2.6
  Bottom 0.127: v13.34,36.83 15.24,38.73 v15.24,41.91
SWCLK*  (via drill 0.35)
  Top 0.127: U1.37 15.88,27.54 15.88,17.78 14.61,16.51 14.61,14.61 15.24,13.97 v15.24,9.53 15.24,7.62
  Top 0.152: J3.2 18.48,4.38 15.24,7.62
  Bottom 0.127: J2.19 v15.24,9.53 13.34,9.53 J4.4
SWDIO*  (via drill 0.35)
  Top 0.127: U1.34 12.54,26.19 14.61,24.13 14.61,17.14 13.97,16.51 13.97,14.61 v14.61,13.97 14.61,10.79 | 14.61,10.79 14.61,6.35 16.35,4.6 | J4.2 14.61,10.79
  Top 0.152: 16.35,4.6 J3.1
  Bottom 0.127: J2.17 19.05,13.97 v14.61,13.97
SWO*  (via drill 0.35)
  Top 0.127: U1.39 16,29.36 18.16,27.2 18.16,17.5 v17.79,17.13 17.79,8.9 v17.78,8.89 17.78,6.99
  Top 0.152: J3.3 20.41,4.35 17.78,6.99
  Bottom 0.127: J2.16 17.81,17.14 v17.79,17.13 | v17.78,8.89 12.7,8.89 J4.6
USB_DM*
  Top 0.127: U1.32 11.54,25.92 12.06,25.4 12.06,19.05 10.79,17.77 10.79,14.8 10.79,14.79 10.79,14.61 10.16,13.97 7.62,13.97 5.71,12.06 5.71,10.16 | 5.71,10.16 5.71,6.99 6.79,5.91 J5.2 | J9.8 5.08,9.53 5.71,10.16
USB_DP*  (via drill 0.35)
  Top 0.127: U1.33 12.06,26.84 12.06,26.04 12.7,25.4 12.7,16.57 R1.1 11.43,14.61 10.16,13.34 7.62,13.34 6.99,12.7 6.99,12.03 arc90 7.21,11.81 7.25,11.81 arc-90 7.48,11.59 7.48,11.35 arc-90 7.25,11.12 6.71,11.12 arc90 6.49,10.9 6.49,10.66 arc90 6.71,10.44 7.25,10.44 arc-90 7.48,10.21 7.48,9.97 arc-90 7.25,9.75 7.21,9.75 arc90 6.99,9.53 6.99,8.71 | J5.3 6.99,8.71 | 6.99,8.71 6.81,8.71 v6.35,8.26
  Bottom 0.127: v6.35,8.26 5.08,6.99 J9.9
VBAT_1.8-3.6V
  Top 0.254: U1.1 13.98,34.92 R2.1 15.93,36.12 C8.1 19.68,39.87 J2.7
VDD  (via drill 0.35)
  Top 0.127: R1.2 v11.43,17.78 | R7.2 5.08,48.31 v5.08,48.26
  Top 0.254: v13.97,38.1 14.23,37.84 Q2.4 16.11,37.84 C11.1 | v13.97,34.29 14.39,33.87 U1.48 16.93,33.87 | v7.62,27.94 7.2,28.36 U1.24 5.62,27.44 C3.1 | v13.34,28.57 13.54,28.36 U1.36 15.18,26.86 C4.1 C2.1 | 16.93,33.87 17.16,34.09 17.16,34.85 R2.2 | L1.2 5.46,40.39 v5.71,40.64 | v10.79,39.37 11.06,39.63 Q1.4 11.06,41.51 C10.1 | U2.2 v6.35,22.23 | U2.TER v8.89,22.23 | C5.1 17.78,33.02 16.93,33.87
  pour Bottom: 0,57.15 21.59,57.15 21.59,0 0,0
VIN
  Top 0.254: D1.C D2.C | D2.C 7.57,18.47 6.1,19.94 U2.3 | D2.C 8.9,17.14 9.53,16.52 C1.1
VIN_4.8-15V
  Top 0.254: J9.6 1.91,15.19 D2.A
VUSB
  Top 0.254: J9.7 1.91,12.7 3.87,14.66 D1.A
  Bottom 0.254: J9.7 3.81,12.06 6.99,8.89 J5.1

### Text on the board
tPlace: A | A | A | C | B | B | A | USB Breakout | ST-Link
tNames: 4 | PWR | USER | 3 | <0> BOOT0 <1> | 5 | A / V | + - | + - | 6 | 2 | <0> BOOT1 <1> | 7 | 1 | 0 | 0 | 1 | A3-LED2 | 1 / 3 | 2 | * | B / T | 1 / 0 | * | * | 9 | 1 / 1 | * | * | 8 | 1 / 2 | * | * | 7 | 1 / 3 | 6 | * | * | 1 / 4 | * | 5 | 1 / 5 | T / R | * | * | 8 | * | * | D / I | 9 | R / S | * | 1 / 0 | * | * | S / W | RESET | V / N | I / O | * | V / U | G / D | D / - | * | J-Link | * | C / K | D / + | * | V / D | G / D | DIO | CLK | SWO | G / D
bNames: -------POWER------- / VDD/AVDD: 2-3.6V. Must be / 3.3V if C39- / 097/C387- / 415 are used / for Q1/Q2. / VUSB: 5V from USB (J5) / VIN: 4.8-15V / BAT: 1.8-3.6V. Short / R2 if unused. / ***WARNING***: Do / NOT power MCU from VDD / if EITHER VIN or USB (J5) / are also being used. / --------GPIO-------- / Max current, ea pin: 25 mA / Max current, total: 150 mA / OUT (minus MCU power, ~7 / -50 mA) and 150 mA IN / (minus MCU power) / *=5V tolerant / USER LED (LED2) on PA3; / Cut trace btwn J8 on BOT- / TOM of PCB to remove / --------BOM-------- / All parts 0402 unless noted. / U1: STM32F103C8T6 / U2: 2-3.6V regulator, >= / 150mA / SOT-223 / J3: Debug Edge connector / J4: J-Link connector / J5: Mini-B; TE 2172034-1 / Q1: 8MHz / 3.2x2.5mm / Q2: 32.768kHz / 3.2x2.5mm / L1: ferrite bead, 0805 (leave / open for AVDD other MCU) / C3, C4, C5, C7-C11: 100nF / R1: 1k5 C6: 1uF / C1, C2: 10uF / R3, R5: 10k | R8, R9: 150R / D1, D2: Shottky / SOD-123 / LED1, LED2: 0603 / R2, R4: 0R (use / R4 in lieu of J6/J7) / S1: SPST- / NO 5.1x / 5.1mm | A3-LED2 | VDD | nRST | GD | FMI: github.com/nathancharlesjones/STM32F103C8T6-breakout-board